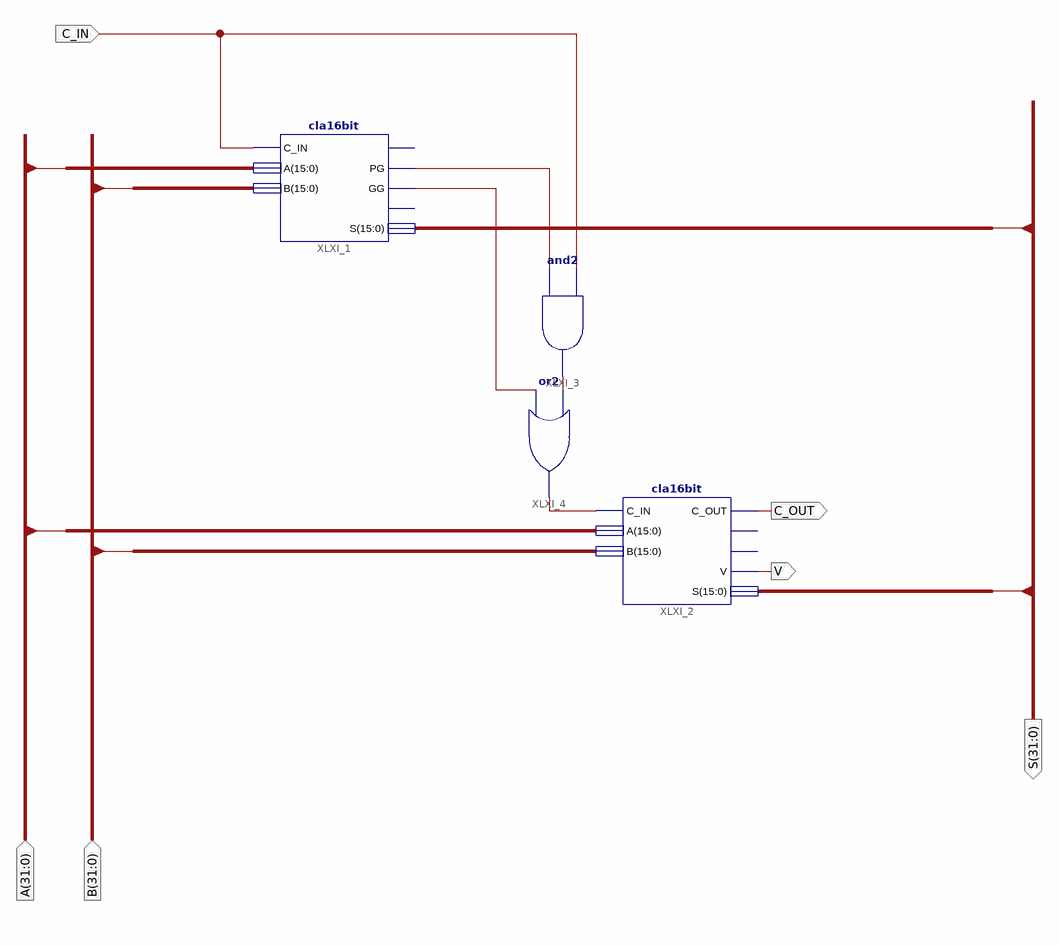
[diagram p0: schematic sheet 1]
// Xilinx ISE schematic cla32bit.sch (spartan3e) as structural Verilog: 4 symbols, 6 ports
module cla32bit (
  input  C_IN,
  input  [31:0] B,
  input  [31:0] A,
  output [31:0] S,
  output V,
  output C_OUT
);

  wire XLXN_1, XLXN_3, XLXN_4, XLXN_6;

  cla16bit XLXI_1 (.C_IN(C_IN), .PG(XLXN_4), .GG(XLXN_6), .S(S[15:0]), .A(A[15:0]), .B(B[15:0]));  // open: C_OUT, V
  cla16bit XLXI_2 (.C_IN(XLXN_1), .C_OUT(C_OUT), .V(V), .S(S[31:16]), .A(A[31:16]), .B(B[31:16]));  // open: PG, GG
  and XLXI_3 (XLXN_3, XLXN_4, C_IN);
  or XLXI_4 (XLXN_1, XLXN_6, XLXN_3);
endmodule
